# EAGLE design Schematics (EAGLE 6.0)
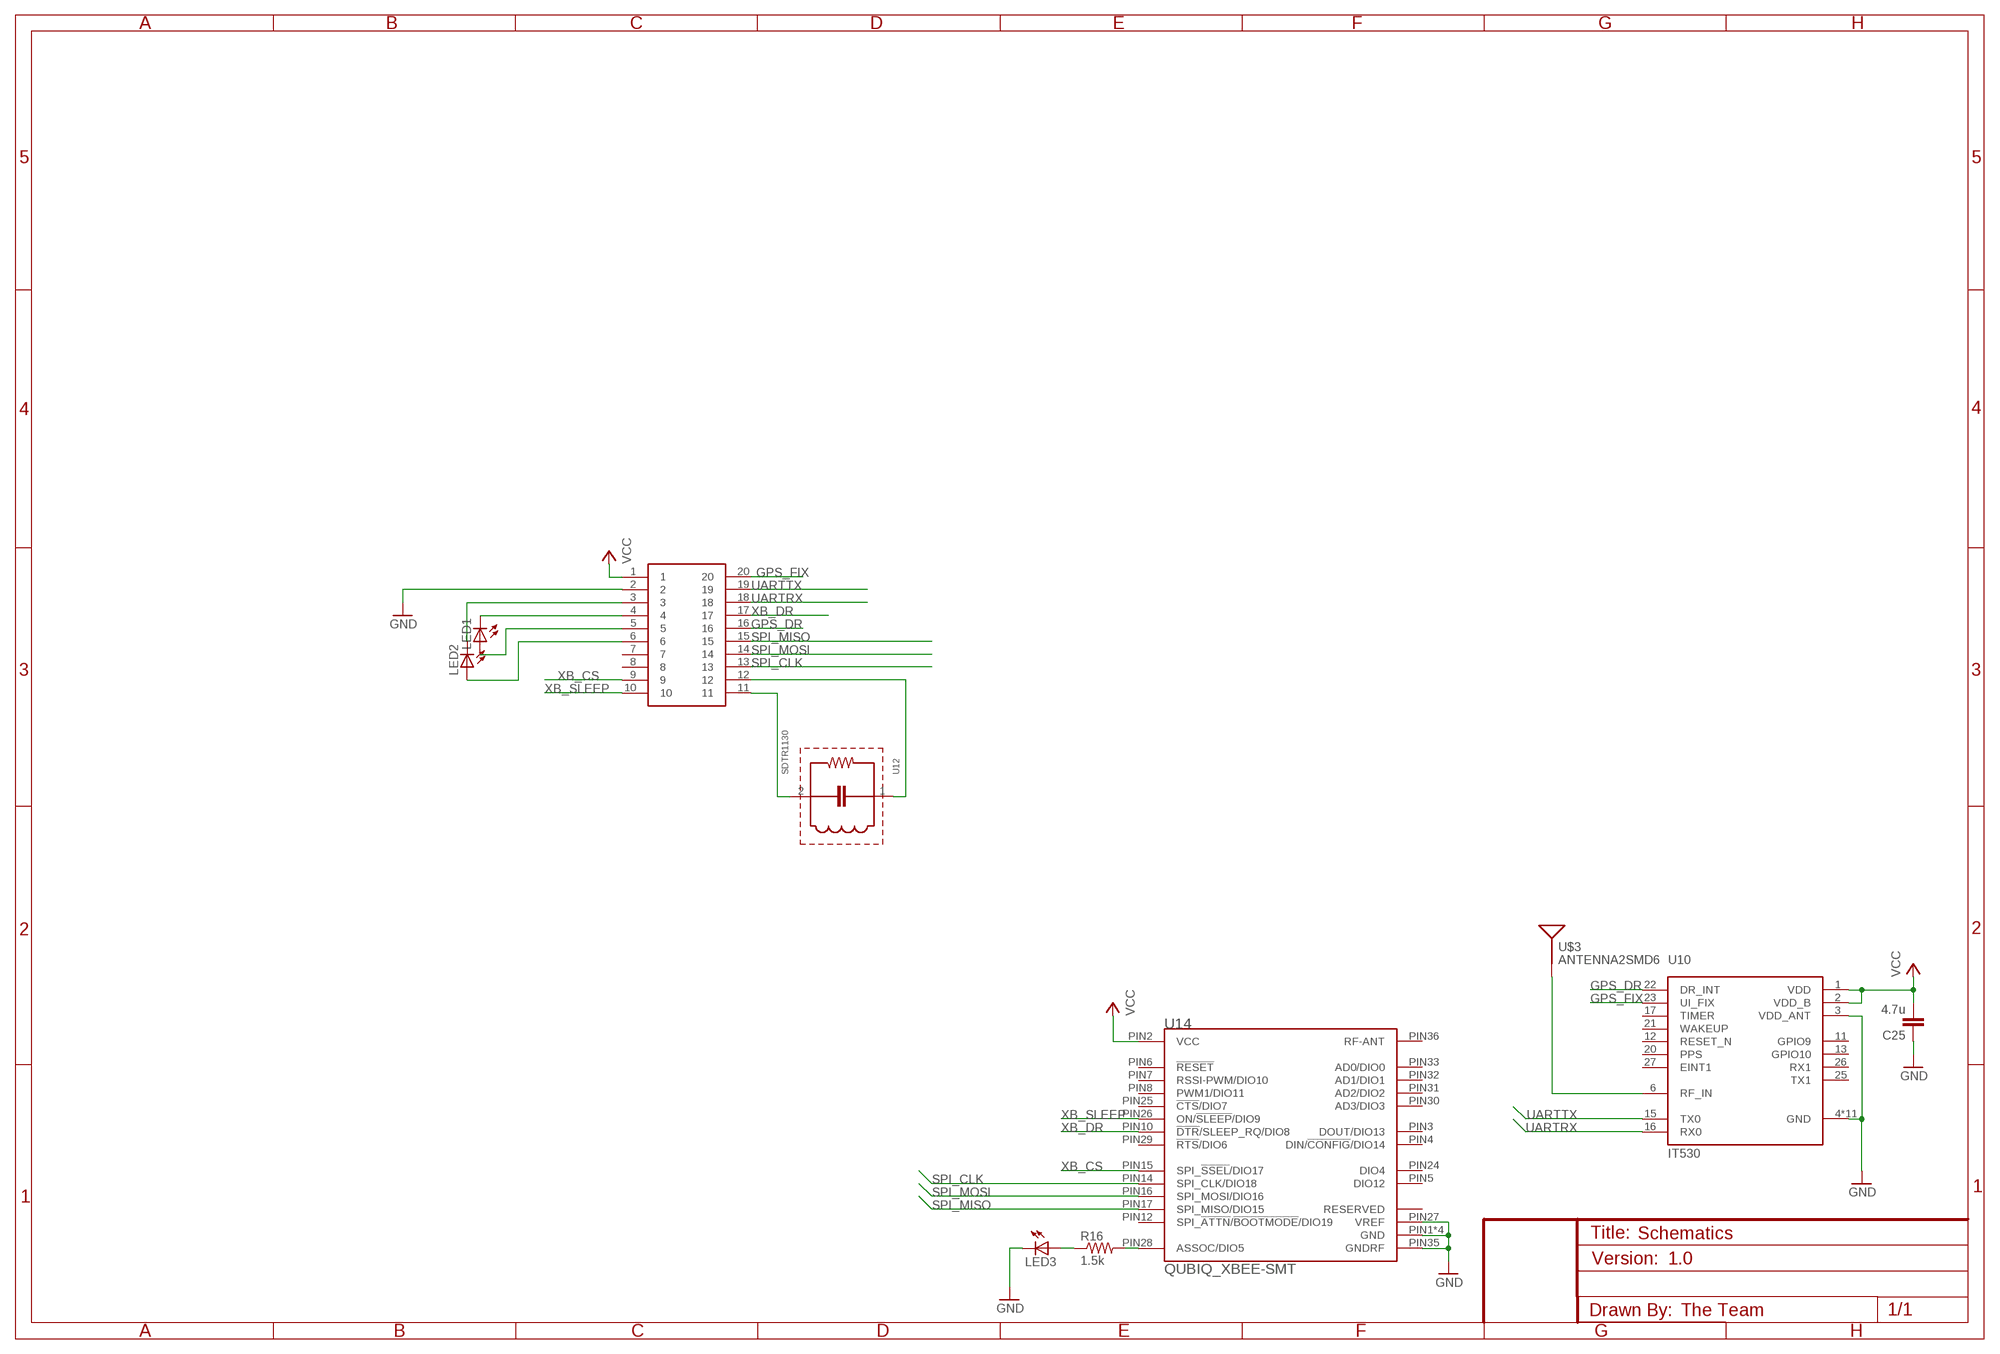
[diagram p0: schematic, sheet 1]

## Parts
C25  4.7u  C-EUC0603  [C0603]
LED1  LED  [SMARTLED-TTW]
LED2  LED  [SMARTLED-TTW]
LED3  LED  [SMARTLED-TTW]
R16  1.5k  R-US_R0603  [R0603]
U10  IT530  [IT530]
U12  SDTR1130  [SDTR1130-SMD]
U14  QUBIQ_XBEE-SMT  [QUBIQ_FLAT-RF]
U$2  20-HEAD  [20-HEAD]
U$3  ANTENNA2SMD6  [ANTENNA-CHIP6]

## Nets
GND: C25.1 LED3.C@1(C) U10.3(VDD_ANT) U10.4(GND) U10.5(GND) U10.7(GND) U10.8(GND) U10.9(GND) U10.10(GND) U10.14(GND) U10.18(GND) U10.19(GND) U10.24(GND) U10.28(GND) U14.PIN1(GND) U14.PIN11(GND) U14.PIN13(GND) U14.PIN22(GND) U14.PIN27(VREF) U14.PIN35(GNDRF) U$2.2
GPS_DR: U10.22(DR_INT) U$2.16
GPS_FIX: U10.23(UI_FIX) U$2.20
N$2: LED2.C@1(C) U$2.3
N$3: LED1.C@1(C) U$2.4
N$4: LED1.A@1(A) U$2.5
N$5: LED2.A@1(A) U$2.6
N$6: U12.2 U$2.11
N$7: U12.1 U$2.12
N$10: R16.2 U14.PIN28(ASSOC/DIO5)
N$11: LED3.A@1(A) R16.1
N$14: U10.6(RF_IN) U$3.1(SIGNAL)
SPI_CLK: U14.PIN14(SPI_CLK/DIO18) U$2.13
SPI_MISO: U14.PIN17(SPI_MISO/DIO15) U$2.15
SPI_MOSI: U14.PIN16(SPI_MOSI/DIO16) U$2.14
UARTRX: U10.16(RX0) U$2.18
UARTTX: U10.15(TX0) U$2.19
VCC: C25.2 U10.1(VDD) U10.2(VDD_B) U14.PIN2(VCC) U$2.1
XB_CS: U14.PIN15(SPI_!SSEL!/DIO17) U$2.9
XB_DR: U14.PIN10(!DTR!/SLEEP_RQ/DIO8) U$2.17
XB_SLEEP: U14.PIN26(ON/!SLEEP!/DIO9) U$2.10
Unconnected: U10.11(GPIO9) U10.12(RESET_N) U10.13(GPIO10) U10.17(TIMER) U10.20(PPS) U10.21(WAKEUP) U10.25(TX1) U10.26(RX1) U10.27(EINT1) U14.PIN3(DOUT/DIO13) U14.PIN4(DIN/!CONFIG!/DIO14) U14.PIN5(DIO12) U14.PIN6(!RESET) U14.PIN7(RSSI-PWM/DIO10) U14.PIN8(PWM1/DIO11) U14.PIN9(RESERVED) U14.PIN12(SPI_!ATTN!/!BOOTMODE!/DIO19) U14.PIN18(RESERVED) U14.PIN19(RESERVED) U14.PIN20(RESERVED) U14.PIN21(RESERVED) U14.PIN23(RESERVED) U14.PIN24(DIO4) U14.PIN25(!CTS!/DIO7) U14.PIN29(!RTS!/DIO6) U14.PIN30(AD3/DIO3) U14.PIN31(AD2/DIO2) U14.PIN32(AD1/DIO1) U14.PIN33(AD0/DIO0) U14.PIN34(RESERVED) U14.PIN36(RF-ANT) U14.PIN37(RESERVED) U$2.7 U$2.8

## Library data of the parts
C25 = rcl:C-EU: CAPACITOR, European symbol
LED1-LED3 = led:LED: LED OSRAM: - CHIPLED LG R971, LG N971, LY N971, LG Q971, LY Q971, LO R971, LY R971 LH N974, LH R974 LS Q976, LO Q976, LY Q976 LO Q996 - Hyper CHIPLED LW Q18S LB Q993, LB Q99A, LB R99A - SideLED LS A670, LO A670, LY A670, LG A670, LP A670 LB A673, LV A673, LT A673, LW A673 LH A674 LY A675 LS A676, LA A676, LO A676, LY A676, LW A676 LS A679, LY A679, LG A679 - Hyper Micro SIDELED® LS Y876, LA Y876, LO Y876, LY Y876 LT Y87S - SmartLED LW L88C, LW L88S LB L89C, LB L89S, LG L890 LS L89K, LO L89K, LY L89K LS L896, LA L896, LO L896, LY L896 - TOPLED LS T670, LO T670, LY T670, LG T670, LP T670 LSG T670, LSP T670, LSY T670, LOP T670, LYG T670 LG T671, LOG T671, LSG T671 LB T673, LV T673, LT T673, LW T673 LH T674 LS T676, LA T676, LO T676, LY T676, LB T676, LH T676, LSB T676, LW T676 LB T67C, LV T67C, LT T67C, LS T67K, LO T67K, LY T67K, LW E67C LS E67B, LA E67B, LO E67B, LY E67B, LB E67C, LV E67C, LT E67C LW T67C LS T679, LY T679, LG T679 LS T770, LO T770, LY T770, LG T770, LP T770 LB T773, LV T773, LT T773, LW T773 LH T774 LS E675, LA E675, LY E675, LS T675 LS T776, LA T776, LO T776, LY T776, LB T776 LHGB T686 LT T68C, LB T68C - Hyper Mini TOPLED® LB M676 - Mini TOPLED Santana® LG M470 LS M47K, LO M47K, LY M47K Source: http://www.osram.convergy.de LUXEON: - LUMILED® LXK2-PW12-R00, LXK2-PW12-S00, LXK2-PW14-U00, LXK2-PW14-V00 LXK2-PM12-R00, LXK2-PM12-S00, LXK2-PM14-U00 LXK2-PE12-Q00, LXK2-PE12-R00, LXK2-PE12-S00, LXK2-PE14-T00, LXK2-PE14-U00 LXK2-PB12-K00, LXK2-PB12-L00, LXK2-PB12-M00, LXK2-PB14-N00, LXK2-PB14-P00, LXK2-PB14-Q00 LXK2-PR12-L00, LXK2-PR12-M00, LXK2-PR14-Q00, LXK2-PR14-R00 LXK2-PD12-Q00, LXK2-PD12-R00, LXK2-PD12-S00 LXK2-PH12-R00, LXK2-PH12-S00 LXK2-PL12-P00, LXK2-PL12-Q00, LXK2-PL12-R00 Source: www.luxeon.com KINGBRIGHT: KA-3528ASYC Source: www.kingbright.com
R16 = rcl:R-US_: RESISTOR, American symbol
U10 = Micro2:IT530: IT530 Datasheet <http://www.u-blox.com/images/downloads/Product_Docs/IT530_DataSheet_%28FTX-HW-12008%29.pdf>
U12 = Micro2:SDTR1130
U14 = Micro2:QUBIQ_XBEE-SMT
U$2 = Micro2:20-HEAD
U$3 = SparkFun-RF:ANTENNA2: Chip antenna Single endded antenna. Common with smaller chip antennas. CHIP4 package is the GPS Chip Antenna SKU: GPS-08418. CHIP5 package is 2.4GHz chip antenna SKU: WRL-00144.

## Board
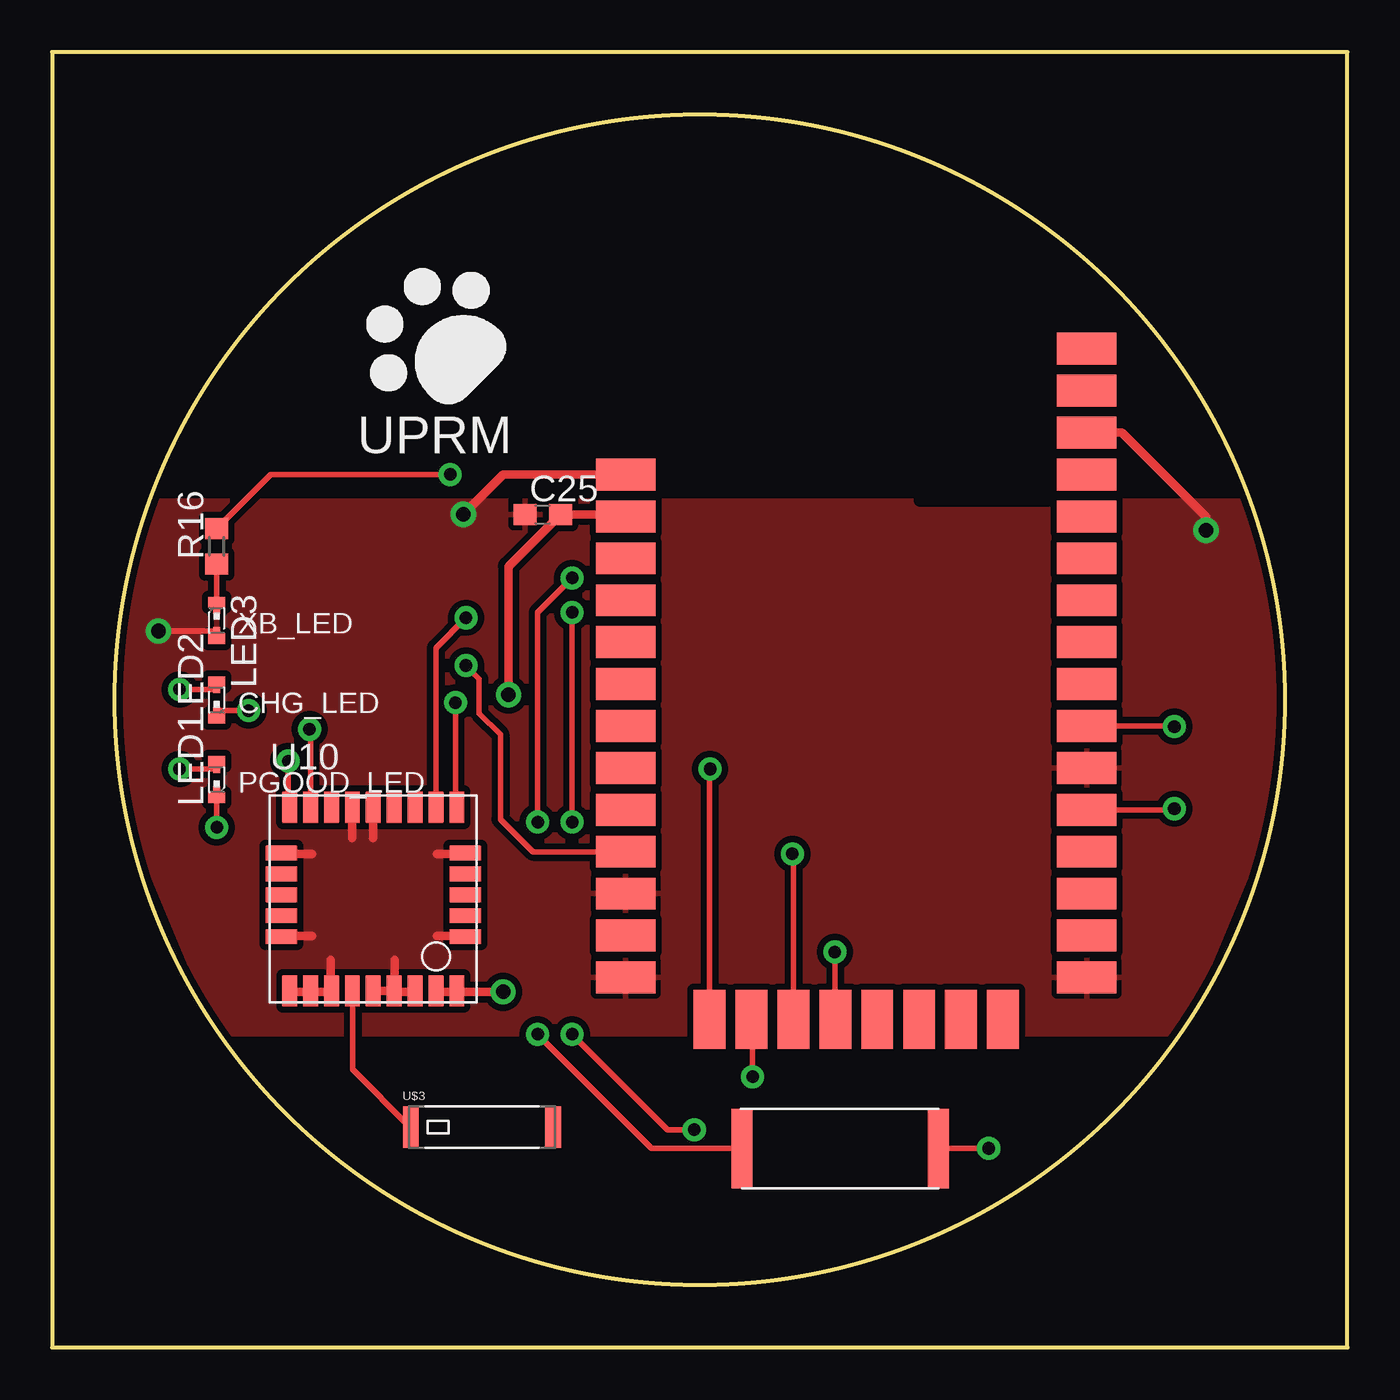
[diagram p1: board, top side]
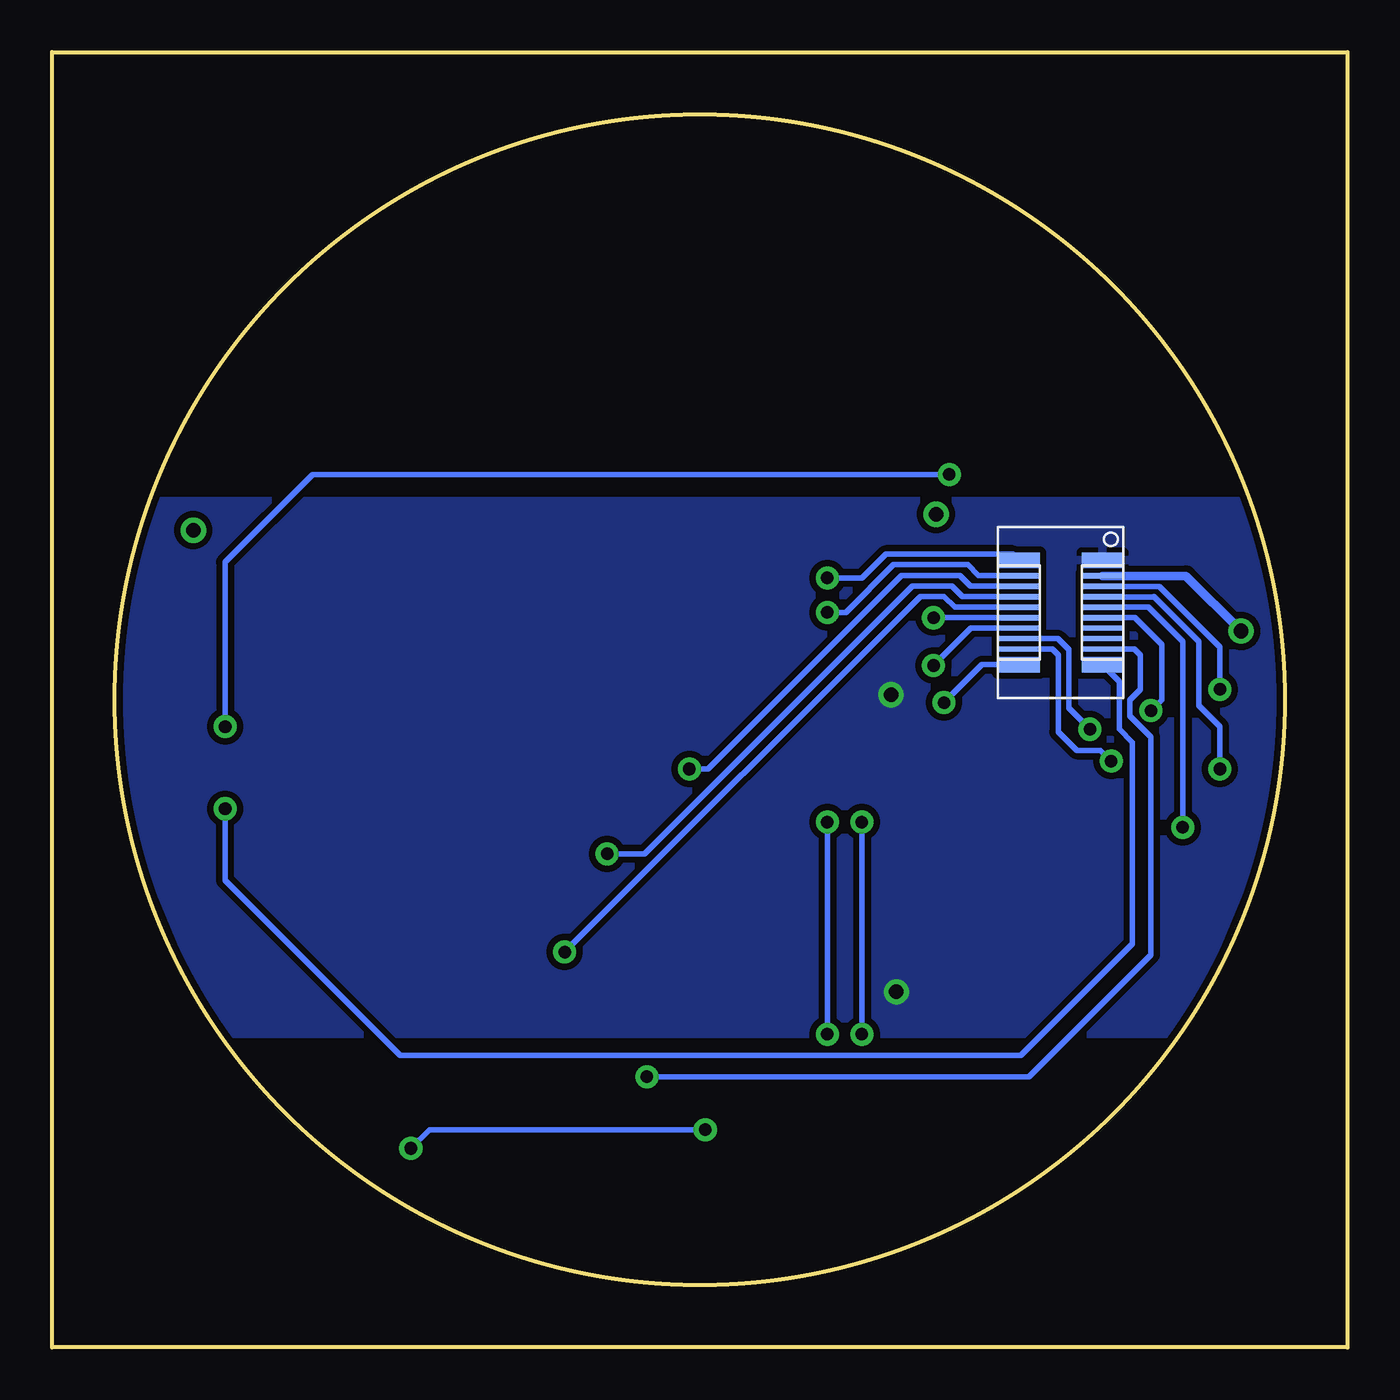
[diagram p2: board, bottom side, seen from below]

Size 62 x 62 mm. Coordinates in mm from the lower left corner, seen from the top.
Outline: 0,0 62,0 62,62 0,62 0,0
Outline: circle at 31,31 radius 28
Copper layers (1*16): Top 0.035mm / dielectric 1.5mm / Bottom 0.035mm
Design rules: minimum track width 8mil, minimum drill 20mil, track to track 8mil, track to pad 8mil, pad to pad 8mil, via to via 8mil, smd to smd 8mil, copper to edge 10mil, drill to drill 8mil, minimum pad ring 12mil, minimum via ring 10mil, stop-mask expansion 4mil, vias tented up to drill 25mil, thermal gap 10mil

### Footprints (pad centres in the part's own frame; a part is rotated, then mirrored left to right if it is on the bottom)
C0603 = smd 1.1 x 1: 1 -0.85,0; 2 0.85,0
SMARTLED-TTW = smd 0.8 x 0.5: A 0,-0.875; C 0,0.875 | smd 0.35 x 0.35: A@1 0,-0.5; C@1 0,0.5
R0603 = smd 1 x 1.1: 1 -0.85,0; 2 0.85,0
IT530 = smd 0.711 x 1.422: 1 -0.95,0.55; 2 -1.95,0.55; 3 -2.95,0.55; 4 -3.95,0.55; 5 -4.95,0.55; 6 -5.95,0.55; 7 -6.95,0.55; 8 -7.95,0.55; 9 -8.95,0.55; 15 -8.95,9.35; 16 -7.95,9.35; 17 -6.95,9.35; 18 -5.95,9.35; 19 -4.95,9.35; 20 -3.95,9.35; 21 -2.95,9.35; 22 -1.95,9.35; 23 -0.95,9.35 | smd 1.422 x 0.711: 10 -9.35,3.15; 11 -9.35,4.15; 12 -9.35,5.15; 13 -9.35,6.15; 14 -9.35,7.15; 24 -0.55,7.15; 25 -0.55,6.15; 26 -0.55,5.15; 27 -0.55,4.15; 28 -0.55,3.15
SDTR1130-SMD = smd 1 x 3.8: 1 9.4,1.9; 2 0,1.9
QUBIQ_FLAT-RF = smd 2.845 x 1.524: PIN1 -22.073,10.033; PIN2 -22.073,8.026; PIN3 -22.073,6.02; PIN4 -22.073,4.013; PIN5 -22.073,2.007; PIN6 -22.073,0; PIN7 -22.073,-2.007; PIN8 -22.073,-4.013; PIN9 -22.073,-6.02; PIN10 -22.073,-8.026; PIN11 -22.073,-10.033; PIN12 -22.073,-12.04; PIN13 -22.073,-14.046; PIN22 0,-14.046; PIN23 0,-12.04; PIN24 0,-10.033; PIN25 0,-8.026; PIN26 0,-6.02; PIN27 0,-4.013; PIN28 0,-2.007; PIN29 0,0; PIN30 0,2.007; PIN31 0,4.013; PIN32 0,6.02; PIN33 0,8.026; PIN34 0,10.033; PIN35 0,12.04; PIN36 0,14.046; PIN37 0,16.053 | smd 1.524 x 2.845: PIN14 -18.059,-16.053; PIN15 -16.053,-16.053; PIN16 -14.046,-16.053; PIN17 -12.04,-16.053; PIN18 -10.033,-16.053; PIN19 -8.026,-16.053; PIN20 -6.02,-16.053; PIN21 -4.013,-16.053
20-HEAD = smd 0.75 x 2: 1 -2.5,2; 10 2.5,2; 11 -2.5,-2; 20 2.5,-2 | smd 0.25 x 2: 2 -1.75,2; 3 -1.25,2; 4 -0.75,2; 5 -0.25,2; 6 0.25,2; 7 0.75,2; 8 1.25,2; 9 1.75,2; 12 -1.75,-2; 13 -1.25,-2; 14 -0.75,-2; 15 -0.25,-2; 16 0.25,-2; 17 0.75,-2; 18 1.25,-2; 19 1.75,-2
ANTENNA-CHIP6 = smd 0.75 x 2: 1 -3.4,0; NC 3.4,0

### Placement (x,y rotation side)
C25  23.48,39.86 0 top
LED1  7.87,27.18 0 top
LED2  7.87,30.99 0 top
LED3  7.87,34.8 180 top
R16  7.87,38.35 90 top
U10  20.32,16.51 0 top
U12  33.02,7.62 0 top
U14  49.53,31.75 0 top
U$2  13.72,35.18 270 bottom
U$3  20.57,10.54 0 top

### Tracks (layer width: path | path; a pad name or v marks a point on that pad's centre or on a via)
GND  (via drill 0.7)
  Top 0.254: LED3.C@1 v5.09,34.3 v5.08,34.29
  Top 0.406: U14.PIN1 21.59,41.78 v19.68,39.88 | U10.24 19.73,23.62 18.41,23.62 | U10.28 19.75,19.68 18.41,19.68 | U10.14 11.01,23.62 12.45,23.62 | U10.10 10.99,19.68 12.45,19.68 | U10.18 14.35,25.84 14.35,24.38 | U10.19 15.37,24.38 | U10.9 11.41,17.02 12.32,17.02 | 12.32,17.02 13.34,17.02 | 17.4,17.09 U10.3 17.33,17.02 16.38,17.02 | 12.32,17.02 U10.8 | 13.34,17.02 13.34,18.54 | 13.34,17.02 U10.7 | U10.5 U10.4 16.37,17.03 16.38,17.02 | 16.38,17.02 16.38,18.54 | U14.PIN35 51.21,43.79 53.59,41.4 55.24,39.75 v55.24,39.12
  Bottom 0.406: U$2.2 7.72,36.93 v5.08,34.29
  pour Top (isolate 0.305): 3,34 3,27 8,15 54,15 59,27 59,34 57.5,40.5 4.5,40.5
GPS_DR  (via drill 0.6)
  Top 0.254: U10.22 18.37,33.48 v19.81,34.92
  Bottom 0.254: U$2.16 v19.81,34.92
GPS_FIX  (via drill 0.6)
  Top 0.254: U10.23 19.3,25.61 v19.3,30.86
  Bottom 0.254: v19.3,30.86 17.49,32.68 U$2.20
N$2  (via drill 0.6)
  Top 0.254: v6.1,31.5 LED2.C@1
  Bottom 0.254: U$2.3 9,36.43 6.1,33.53 v6.1,31.5
N$3  (via drill 0.6)
  Top 0.254: v6.1,27.69 LED1.C@1
  Bottom 0.254: U$2.4 9.28,35.93 9.27,35.94 7.11,33.78 7.11,30.73 6.1,29.72 v6.1,27.69
N$4  (via drill 0.6)
  Top 0.254: v7.87,24.89 LED1.A@1
  Bottom 0.254: U$2.5 9.52,35.43 7.87,33.78 v7.87,24.89
N$5  (via drill 0.6)
  Top 0.254: v9.4,30.48 7.88,30.48 LED2.A@1
  Bottom 0.254: U$2.6 10.16,34.93 8.89,33.66 8.89,30.99 v9.4,30.48
N$6  (via drill 0.6)
  Top 0.254: v24.89,36.83 23.24,35.18 v23.24,25.15 | v23.24,14.99 28.7,9.53 29.34,9.53 29.34,9.52 U12.2
  Bottom 0.254: U$2.11 16.01,37.97 22.1,37.97 23.24,36.83 v24.89,36.83 | v23.24,25.15 v23.24,14.99
N$7  (via drill 0.6)
  Top 0.254: v24.89,35.18 24.89,25.91 v24.89,25.15 | v24.89,14.99 29.46,10.41 v30.73,10.41 | v44.83,9.53 42.55,9.53 42.48,9.46 | 42.48,9.46 42.42,9.4 | U12.1 42.48,9.46
  Bottom 0.254: U$2.12 15.74,36.96 17.65,36.96 18.16,37.47 21.72,37.47 24,35.18 v24.89,35.18 | v24.89,25.15 v24.89,14.99 | v30.73,10.41 43.94,10.41 v44.83,9.53
N$10  (via drill 0.6)
  Top 0.254: R16.2 10.45,41.78 v19.05,41.78 | v53.72,29.72 53.7,29.74 U14.PIN28
  Bottom 0.254: v19.05,41.78 49.53,41.78 53.72,37.59 v53.72,29.72
N$11
  Top 0.254: R16.1 LED3.A@1
N$14
  Top 0.254: U10.6 14.37,13.32 17.14,10.54 U$3.1
SPI_CLK  (via drill 0.6)
  Top 0.254: v31.5,27.69 31.47,27.66 U14.PIN14
  Bottom 0.254: U$2.13 15.74,36.45 18.03,36.45 18.54,36.96 21.34,36.96 30.61,27.69 v31.5,27.69
SPI_MISO  (via drill 0.6)
  Top 0.254: v37.47,18.92 37.47,15.75 37.47,15.72 U14.PIN17
  Bottom 0.254: U$2.15 18.8,35.43 19.3,35.94 20.45,35.94 v37.47,18.92
SPI_MOSI  (via drill 0.6)
  Top 0.254: v35.43,23.62 35.48,23.57 U14.PIN16
  Bottom 0.254: 15.62,35.94 15.7,35.94 U$2.14 15.73,35.94 18.41,35.94 18.92,36.45 20.83,36.45 33.66,23.62 v35.43,23.62
UARTRX  (via drill 0.6)
  Top 0.254: 12.32,25.68 U10.16 12.37,29.54 v12.32,29.59
  Bottom 0.254: U$2.18 13.86,33.93 13.34,33.4 13.34,30.61 v12.32,29.59
UARTTX  (via drill 0.6)
  Top 0.254: v11.3,28.07 11.3,25.67 U10.15
  Bottom 0.254: U$2.19 14.12,33.43 13.84,33.15 13.84,29.46 12.95,28.57 11.81,28.57 v11.3,28.07
VCC  (via drill 0.7)
  Top 0.254: U10.1 19.39,17.06 19.43,17.02
  Top 0.406: U14.PIN2 27.37,39.86 C25.2 21.84,37.38 v21.84,31.24 | U10.2 18.41,17.02 19.3,17.02 19.43,17.02 v21.59,17.02
  pour Bottom (isolate 0.305): 3,27 3,34 4.5,40.5 57.5,40.5 59,34 59,27 54,15 8,15
XB_CS  (via drill 0.6)
  Top 0.254: v33.53,12.95 33.53,15.62 33.53,15.65 U14.PIN15
  Bottom 0.254: U$2.9 10.19,33.43 9.91,33.15 9.91,31.5 10.41,30.99 10.41,30.23 9.4,29.21 9.4,18.8 15.24,12.95 v33.53,12.95
XB_DR  (via drill 0.6)
  Top 0.254: v19.81,32.64 20.45,32 20.45,30.35 21.46,29.34 21.46,25.27 23.01,23.72 U14.PIN10
  Bottom 0.254: U$2.17 18.02,34.43 v19.81,32.64
XB_SLEEP  (via drill 0.6)
  Top 0.254: v53.72,25.78 53.67,25.73 U14.PIN26
  Bottom 0.254: U$2.10 10.92,31.89 10.92,29.59 10.29,28.96 10.29,19.3 15.62,13.97 45.34,13.97 53.72,22.35 v53.72,25.78

### Text on the board
tPlace: UPRM | XB_LED | CHG_LED | PGOOD_LED